# Altium schematic sheet Output_Retime.SchDoc
size A4; SheetNumber: 4; SheetTotal: 7
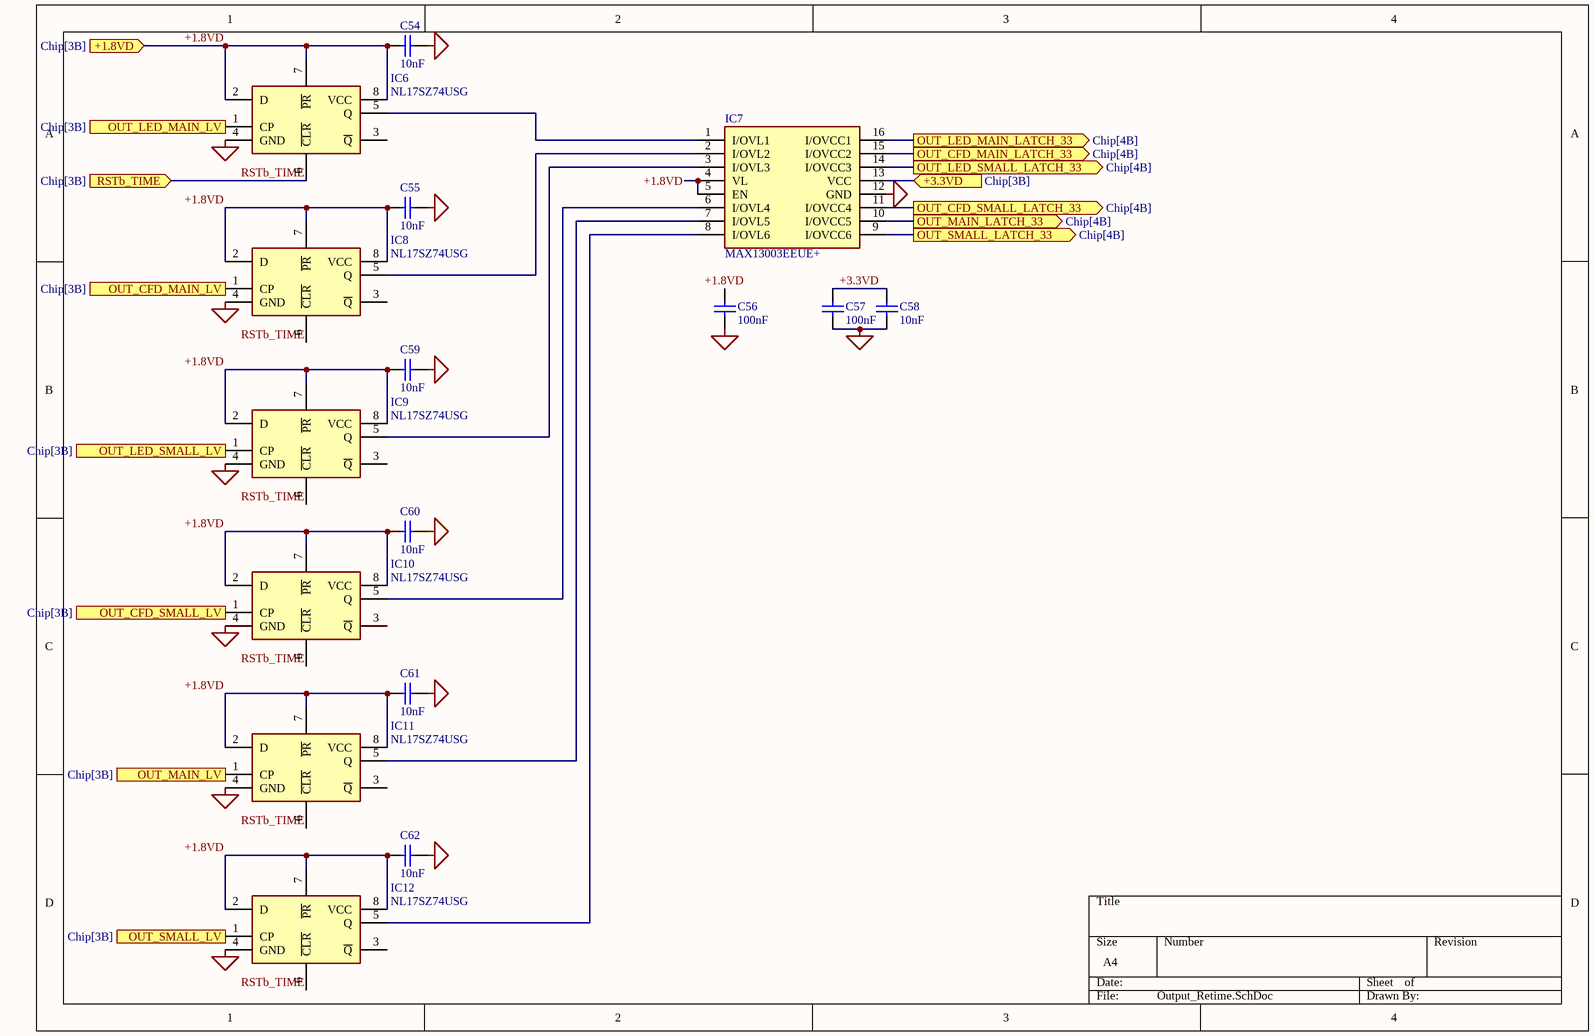
[diagram p0: Output_Retime.SchDoc]

## Parts
C54  10nF  [CAPC1608X90X35ML10T15]
C55  10nF  [CAPC1608X90X35ML10T15]
C56  100nF  [CAPC1608X90X35ML10T15]
C57  100nF  [CAPC1608X90X35ML10T15]
C58  10nF  [CAPC1608X90X35ML10T15]
C59  10nF  [CAPC1608X90X35ML10T15]
C60  10nF  [CAPC1608X90X35ML10T15]
C61  10nF  [CAPC1608X90X35ML10T15]
C62  10nF  [CAPC1608X90X35ML10T15]
IC6  NL17SZ74USG  [SOP50P310X90-8N]
IC7  MAX13003EEUE+  [SOP65P640X110-16N]
IC8  NL17SZ74USG  [SOP50P310X90-8N]
IC9  NL17SZ74USG  [SOP50P310X90-8N]
IC10  NL17SZ74USG  [SOP50P310X90-8N]
IC11  NL17SZ74USG  [SOP50P310X90-8N]
IC12  NL17SZ74USG  [SOP50P310X90-8N]

## Ports
+1.8VD (in, see Chip[3B]), +3.3VD (in, see Chip[3B]), OUT_CFD_MAIN_LATCH_33 (out, see Chip[4B]), OUT_CFD_MAIN_LV (in, see Chip[3B]), OUT_CFD_SMALL_LATCH_33 (out, see Chip[4B]), OUT_CFD_SMALL_LV (in, see Chip[3B]), OUT_LED_MAIN_LATCH_33 (out, see Chip[4B]), OUT_LED_MAIN_LV (in, see Chip[3B]), OUT_LED_SMALL_LATCH_33 (out, see Chip[4B]), OUT_LED_SMALL_LV (in, see Chip[3B]), OUT_MAIN_LATCH_33 (out, see Chip[4B]), OUT_MAIN_LV (in, see Chip[3B]), OUT_SMALL_LATCH_33 (out, see Chip[4B]), OUT_SMALL_LV (in, see Chip[3B]), RSTb_TIME (in, see Chip[3B])

## Nets
GND: C54.1 C55.1 C56.1 C57.1 C58.1 C59.1 C60.1 C61.1 C62.1 IC6.4(GND) IC7.12(GND) IC8.4(GND) IC9.4(GND) IC10.4(GND) IC11.4(GND) IC12.4(GND)
+1.8VD: C54.2 C55.2 C56.2 C59.2 C60.2 C61.2 C62.2 IC6.2(D) IC6.7(~{PR}) IC6.8(VCC) IC7.4(VL) IC7.5(EN) IC8.2(D) IC8.7(~{PR}) IC8.8(VCC) IC9.2(D) IC9.7(~{PR}) IC9.8(VCC) IC10.2(D) IC10.7(~{PR}) IC10.8(VCC) IC11.2(D) IC11.7(~{PR}) IC11.8(VCC) IC12.2(D) IC12.7(~{PR}) IC12.8(VCC) ; port +1.8VD
+3.3VD: IC7.13(VCC) ; port +3.3VD
+3.3VD: C57.2 C58.2  [a separate net that carries the same name]
OUT_CFD_MAIN_LATCH_33: IC7.15(I/OVCC2) ; port OUT_CFD_MAIN_LATCH_33
OUT_CFD_MAIN_LV: IC8.1(CP) ; port OUT_CFD_MAIN_LV
OUT_CFD_SMALL_LATCH_33: IC7.11(I/OVCC4) ; port OUT_CFD_SMALL_LATCH_33
OUT_CFD_SMALL_LV: IC10.1(CP) ; port OUT_CFD_SMALL_LV
OUT_LED_MAIN_LATCH_33: IC7.16(I/OVCC1) ; port OUT_LED_MAIN_LATCH_33
OUT_LED_MAIN_LV: IC6.1(CP) ; port OUT_LED_MAIN_LV
OUT_LED_SMALL_LATCH_33: IC7.14(I/OVCC3) ; port OUT_LED_SMALL_LATCH_33
OUT_LED_SMALL_LV: IC9.1(CP) ; port OUT_LED_SMALL_LV
OUT_MAIN_LATCH_33: IC7.10(I/OVCC5) ; port OUT_MAIN_LATCH_33
OUT_MAIN_LV: IC11.1(CP) ; port OUT_MAIN_LV
OUT_SMALL_LATCH_33: IC7.9(I/OVCC6) ; port OUT_SMALL_LATCH_33
OUT_SMALL_LV: IC12.1(CP) ; port OUT_SMALL_LV
RSTb_TIME: IC6.6(~{CLR}) IC8.6(~{CLR}) IC9.6(~{CLR}) IC10.6(~{CLR}) IC11.6(~{CLR}) IC12.6(~{CLR}) ; port RSTb_TIME
NetIC6_5: IC6.5(Q) IC7.1(I/OVL1)
NetIC7_2: IC7.2(I/OVL2) IC8.5(Q)
NetIC7_3: IC7.3(I/OVL3) IC9.5(Q)
NetIC7_6: IC7.6(I/OVL4) IC10.5(Q)
NetIC7_7: IC7.7(I/OVL5) IC11.5(Q)
NetIC7_8: IC7.8(I/OVL6) IC12.5(Q)

Not connected (* = marked no-connect by the designer): IC6 3(~{Q}); IC8 3(~{Q}); IC9 3(~{Q}); IC10 3(~{Q}); IC11 3(~{Q}); IC12 3(~{Q})

## Library data of the parts
C54-C62 = CMP-2000-04945-1: 0603; Manufacturer: Murata; Capacitance: 22pF; Tolerance (%): ±5%; Rated Voltage: 50V; Dielectric: C0G; Manufacturer URL: http://www.murata.com/; Datasheet Version: Jul-06; Package Reference: 603; Case Size/Dimension: 0603; Package Description: 2-Pin Surface Mount Device, Body 1.6 x 0.8 mm; Datasheet URL: https://datasheet.ciiva.com/11786/0900766b807a1cab-11786398.pdf
IC6 IC8-IC12 = NL17SZ74USG: Flip Flops 1.65-5.5V CMOS Single D-Type; Manufacturer_Name: ON Semiconductor; Datasheet Link: http://www.onsemi.com/pub/Collateral/NL17SZ74-D.PDF; Height: 0.9mm; Manufacturer_Part_Number: NL17SZ74USG
IC7 = MAX13003EEUE+: Integrated Circuit; Manufacturer_Name: Maxim Integrated; Datasheet Link: https://pdfserv.maximintegrated.com/en/ds/MAX13000E-MAX13005E.pdf; Height: 1.1mm; Manufacturer_Part_Number: MAX13003EEUE+